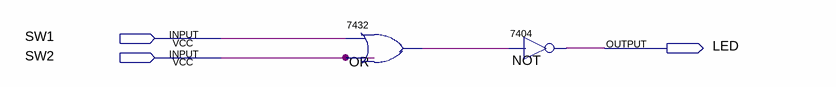
[diagram p0: schematic sheet]
// Quartus schematic Block1.bdf as structural Verilog: 2 symbols, 3 pins
module Block1 (
  input  SW1,
  input  SW2,
  output LED
);

  wire OR_1;

  \7432  OR (.\2 (SW1), .\3 (SW2), .\1 (OR_1));
  \7404  NOT (.\2 (OR_1), .\1 (LED));
endmodule
